# Altium schematic sheet 04_Power_Diagram_rk816.SchDoc
size 297 x 209 mm
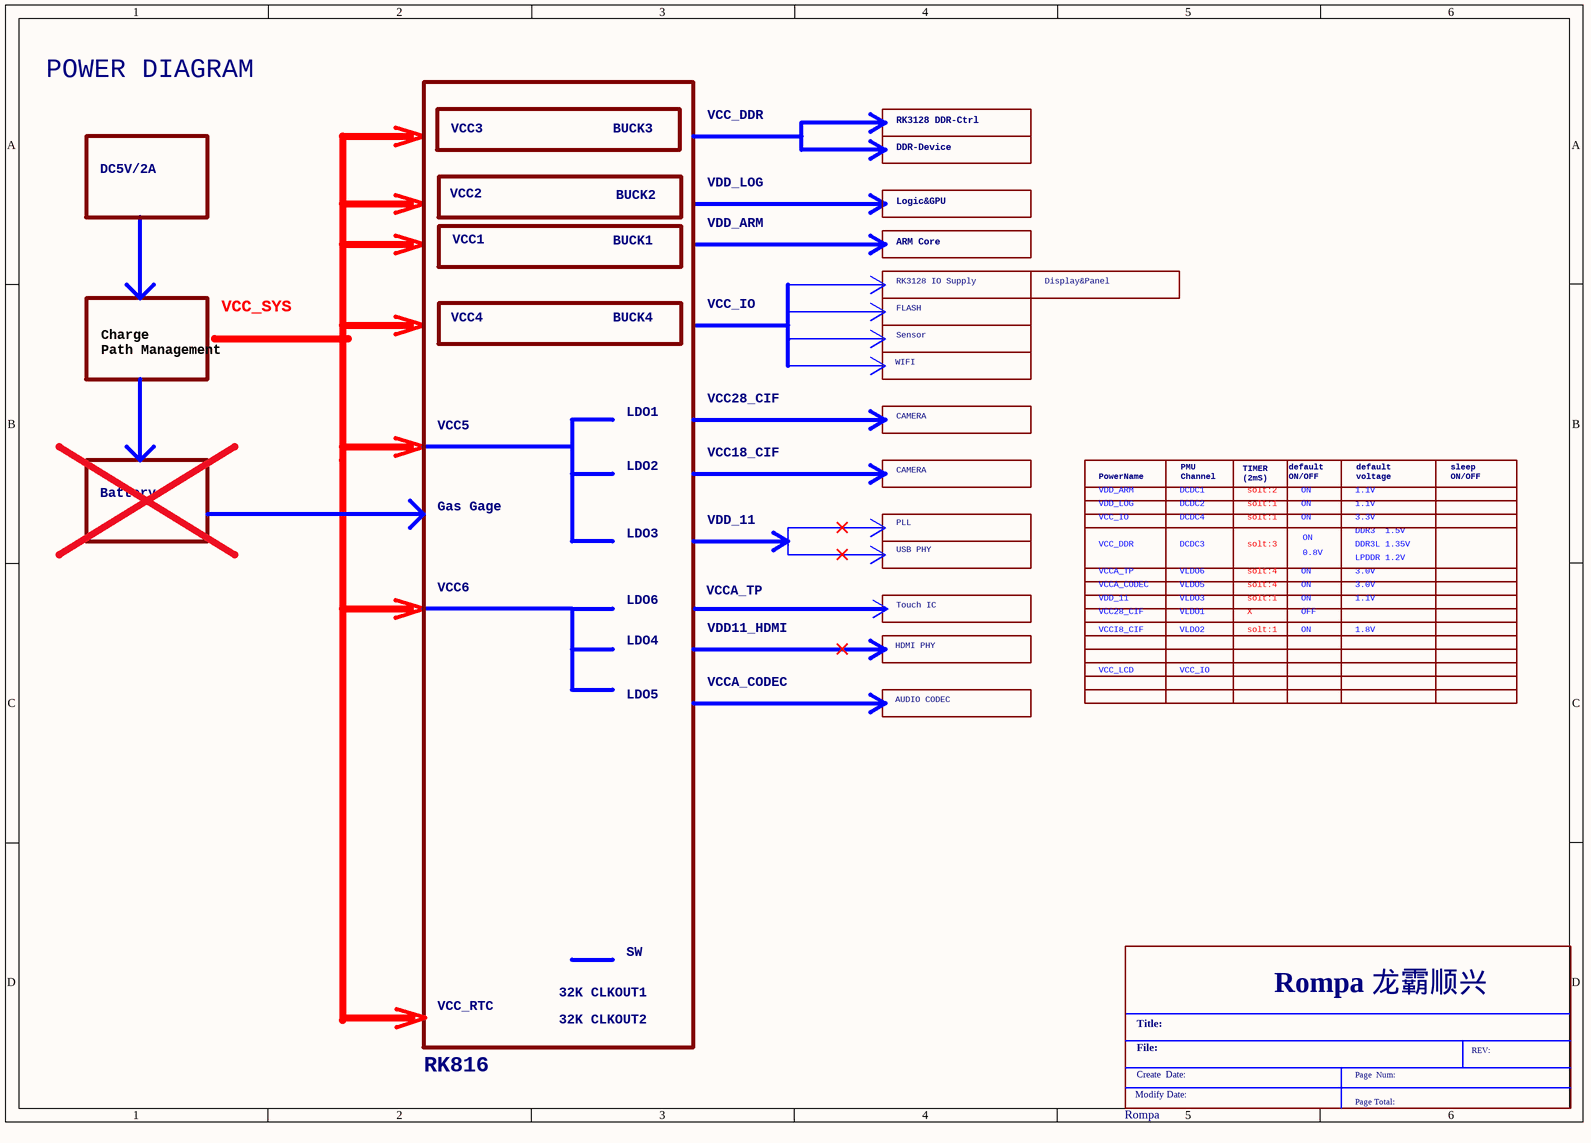
[diagram p0: 04_Power_Diagram_rk816.SchDoc]

## Parts
*  Rompa  (graphical)

## Notes on the sheet
- POWER DIAGRAM
- VCC3
- BUCK3
- VCC_DDR
- RK3128 DDR-Ctrl
- DC5V/2A
- VCC2
- BUCK2
- VDD_LOG
- DDR-Device
- Logic&GPU
- VCC1
- BUCK1
- VDD_ARM
- ARM Core
- VCC_SYS
- VCC4
- BUCK4
- VCC_IO
- RK3128 IO Supply
- FLASH
- Sensor
- Display&Panel
- Charge
  Path Management
- VCC28_CIF
- WIFI
- VCC5
- LDO2
- LDO1
- VCC18_CIF
- CAMERA
- Battery
- Gas Gage
- LDO3
- VDD_11
- PLL
- PowerName
- DCDC4
- PMU
  Channel
- DCDC2
- DCDC1
- TIMER
  (2mS)
- solt:1
- solt:2
- default
  ON/OFF
- ON
- default
  voltage
- 1.1V
- DDR3  1.5V
- 3.3V
- sleep
  ON/OFF
- VCC6
- LDO6
- VCCA_TP
- Touch IC
- USB PHY
- VCCA_CODEC
- DCDC3
- VLDO3
- VLDO5
- VLDO6
- solt:3
- solt:4
- 0.8V
- 3.0V
- LPDDR 1.2V
- DDR3L 1.35V
- LDO4
- VDD11_HDMI
- HDMI PHY
- VCC_LCD
- VCCI8_CIF
- VLDO1
- VLDO2
- X
- OFF
- 1.8V
- LDO5
- AUDIO CODEC
- VCC_RTC
- 32K CLKOUT1
- SW
- RK816
- 32K CLKOUT2
- (in symbol Rompa) Rompa 龙霸顺兴; Title:; File:; REV:; Create  Date:; Page  Num:; Modify Date:; Page Total: